# Altium schematic sheet MT8365_Camera.SchDoc
size A4; SheetNumber: 6; SheetTotal: 36
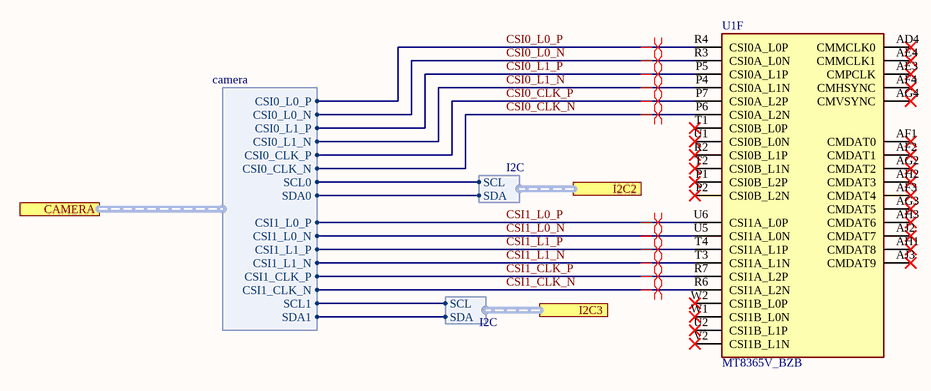
[diagram p0: MT8365_Camera.SchDoc]

## Parts
U1  MT8365V_BZB  [BGA633C40P30X29_1220X1180X90]  (part F of 11)

## Ports
CAMERA (harness camera, see MT8365[9500,6600], Camera[1400,6000], MT8365[10400,6600]), I2C2 (harness I2C, see MT8365[8600,7000], MT8365_CONN[11500,5750]), I2C3 (harness I2C, see MT8365[8400,7000], MT8365_CONN[11500,5550])

## Harnesses
camera: CSI0_L0_P, CSI0_L0_N, CSI0_L1_P, CSI0_L1_N, CSI0_CLK_P, CSI0_CLK_N, CSI1_L0_P, CSI1_L0_N, CSI1_L1_P, CSI1_L1_N, CSI1_CLK_P, CSI1_CLK_N, SCL0, SDA0, SCL1, SDA1
I2C: SCL, SDA

## Nets
CSI0_CLK_N: U1.P6(CSI0A_L2N) ; port CAMERA.CSI0_CLK_N
CSI0_CLK_P: U1.P7(CSI0A_L2P) ; port CAMERA.CSI0_CLK_P
CSI0_L0_N: U1.R3(CSI0A_L0N) ; port CAMERA.CSI0_L0_N
CSI0_L0_P: U1.R4(CSI0A_L0P) ; port CAMERA.CSI0_L0_P
CSI0_L1_N: U1.P4(CSI0A_L1N) ; port CAMERA.CSI0_L1_N
CSI0_L1_P: U1.P5(CSI0A_L1P) ; port CAMERA.CSI0_L1_P
CSI1_CLK_N: U1.R6(CSI1A_L2N) ; port CAMERA.CSI1_CLK_N
CSI1_CLK_P: U1.R7(CSI1A_L2P) ; port CAMERA.CSI1_CLK_P
CSI1_L0_N: U1.U5(CSI1A_L0N) ; port CAMERA.CSI1_L0_N
CSI1_L0_P: U1.U6(CSI1A_L0P) ; port CAMERA.CSI1_L0_P
CSI1_L1_N: U1.T3(CSI1A_L1N) ; port CAMERA.CSI1_L1_N
CSI1_L1_P: U1.T4(CSI1A_L1P) ; port CAMERA.CSI1_L1_P
(unnamed): port CAMERA.SCL0, port I2C2.SCL
(unnamed): port CAMERA.SDA0, port I2C2.SDA
(unnamed): port CAMERA.SCL1, port I2C3.SCL
(unnamed): port CAMERA.SDA1, port I2C3.SDA

Not connected (* = marked no-connect by the designer): U1 AD4(CMMCLK0)* AE3(CMPCLK)* AE4(CMMCLK1)* AF1(CMDAT0)* AF2(CMDAT1)* AF3(CMDAT4)* AF4(CMHSYNC)* AG2(CMDAT2)* AG3(CMDAT5)* AG4(CMVSYNC)* AH1(CMDAT8)* AH2(CMDAT3)* AH3(CMDAT6)* AJ2(CMDAT7)* AJ3(CMDAT9)* P1(CSI0B_L2P)* P2(CSI0B_L2N)* R2(CSI0B_L1P)* T1(CSI0B_L0P)* T2(CSI0B_L1N)* U1(CSI0B_L0N)* U2(CSI1B_L1P)* V2(CSI1B_L1N)* W1(CSI1B_L0N)* W2(CSI1B_L0P)*

## Layout directives
differential pair: CSI0_CLK_N, CSI0_CLK_P, CSI0_L0_N, CSI0_L0_P, CSI0_L1_N, CSI0_L1_P, CSI1_CLK_N, CSI1_CLK_P, CSI1_L0_N, CSI1_L0_P, CSI1_L1_N, CSI1_L1_P

## Library data of the parts
U1 = MT8365V_BZB: SoC; Manufacturer_Name: Mediatek; Manufacturer_Part_Number: MT8365V/BZB; Datasheet Link: https://www.mouser.co.uk/datasheet/2/1074/MT8365_AIoT_Application_Processor_Datasheet_v1_0_2-3106631.pdf; Height: 0.9mm; Mouser Part Number: 840-MT8365V/BZB; Mouser Price/Stock: https://www.mouser.co.uk/ProductDetail/MediaTek/MT8365V-BZB?qs=Jm2GQyTW%2FbjcedX9ugwNWQ%3D%3D